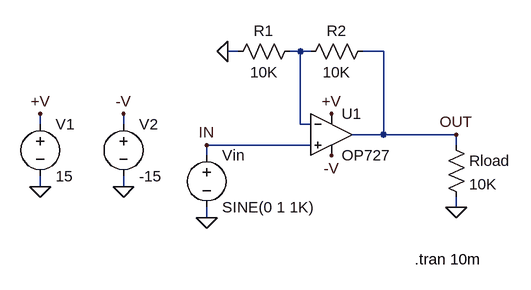
[diagram p0: schematic OP727.asc]
OP727.asc, the LTspice schematic file:
Version 4
SHEET 1 1240 700
WIRE 432 -1232 416 -1232
WIRE 528 -1232 512 -1232
WIRE 544 -1232 528 -1232
WIRE 656 -1232 624 -1232
WIRE 128 -1120 128 -1136
WIRE 256 -1120 256 -1136
WIRE 528 -1120 528 -1232
WIRE 544 -1120 528 -1120
WIRE 656 -1104 656 -1232
WIRE 656 -1104 608 -1104
WIRE 768 -1104 656 -1104
WIRE 544 -1088 384 -1088
WIRE 768 -1088 768 -1104
WIRE 384 -1072 384 -1088
WIRE 128 -1024 128 -1040
WIRE 256 -1024 256 -1040
WIRE 768 -992 768 -1008
WIRE 384 -976 384 -992
FLAG 128 -1136 +V
FLAG 128 -1024 0
FLAG 384 -976 0
FLAG 768 -1104 OUT
FLAG 384 -1088 IN
FLAG 576 -1136 +V
FLAG 256 -1136 -V
FLAG 576 -1072 -V
FLAG 416 -1232 0
FLAG 768 -992 0
FLAG 256 -1024 0
SYMBOL voltage 128 -1136 R0
WINDOW 123 0 0 Left 2
WINDOW 39 0 0 Left 2
SYMATTR InstName V1
SYMATTR Value 15
SYMBOL voltage 384 -1088 R0
WINDOW 123 24 146 Left 2
WINDOW 39 24 125 Left 2
SYMATTR InstName Vin
SYMATTR Value SINE(0 1 1K)
SYMBOL res 528 -1248 R90
WINDOW 0 0 56 VBottom 2
WINDOW 3 32 56 VTop 2
SYMATTR InstName R1
SYMATTR Value 10K
SYMBOL res 640 -1248 R90
WINDOW 0 0 56 VBottom 2
WINDOW 3 32 56 VTop 2
SYMATTR InstName R2
SYMATTR Value 10K
SYMBOL Opamps\\OP727 576 -1168 R0
SYMATTR InstName U1
SYMBOL voltage 256 -1136 R0
WINDOW 123 24 146 Left 2
WINDOW 39 24 125 Left 2
SYMATTR InstName V2
SYMATTR Value -15
SYMBOL res 752 -1104 R0
SYMATTR InstName Rload
SYMATTR Value 10K
TEXT 704 -912 Left 2 !.tran 10m

The netlist it stands for:
* OP727.asc
V1 +V 0 15
Vin IN 0 SINE(0 1 1K)
R1 N001 0 10K
R2 OUT N001 10K
XU1 IN N001 +V -V OUT OP727  ; pins In+ In- V+ V- OUT
V2 -V 0 -15
Rload OUT 0 10K
.tran 10m
.backanno
.end